# EAGLE board zx80 SD_12 (smd) build006.3 (STM32) (EAGLE 9.6.2), part 1 of 2
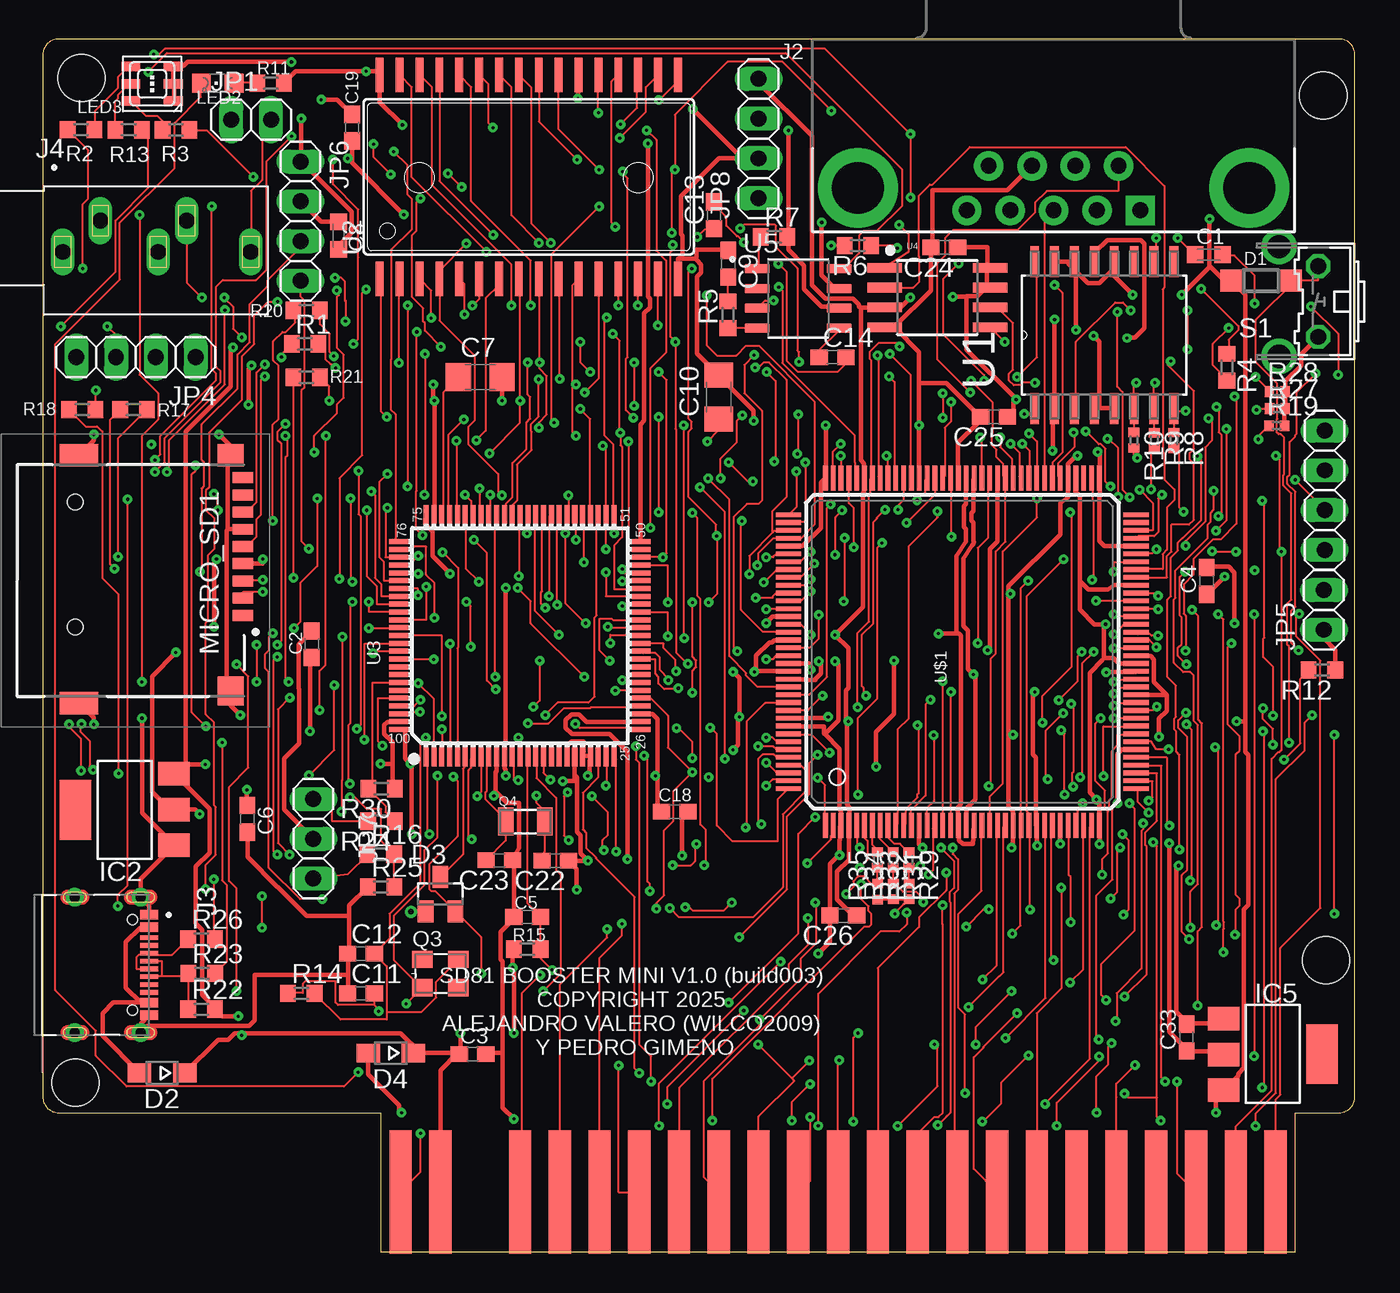
[diagram p3: board, top side]
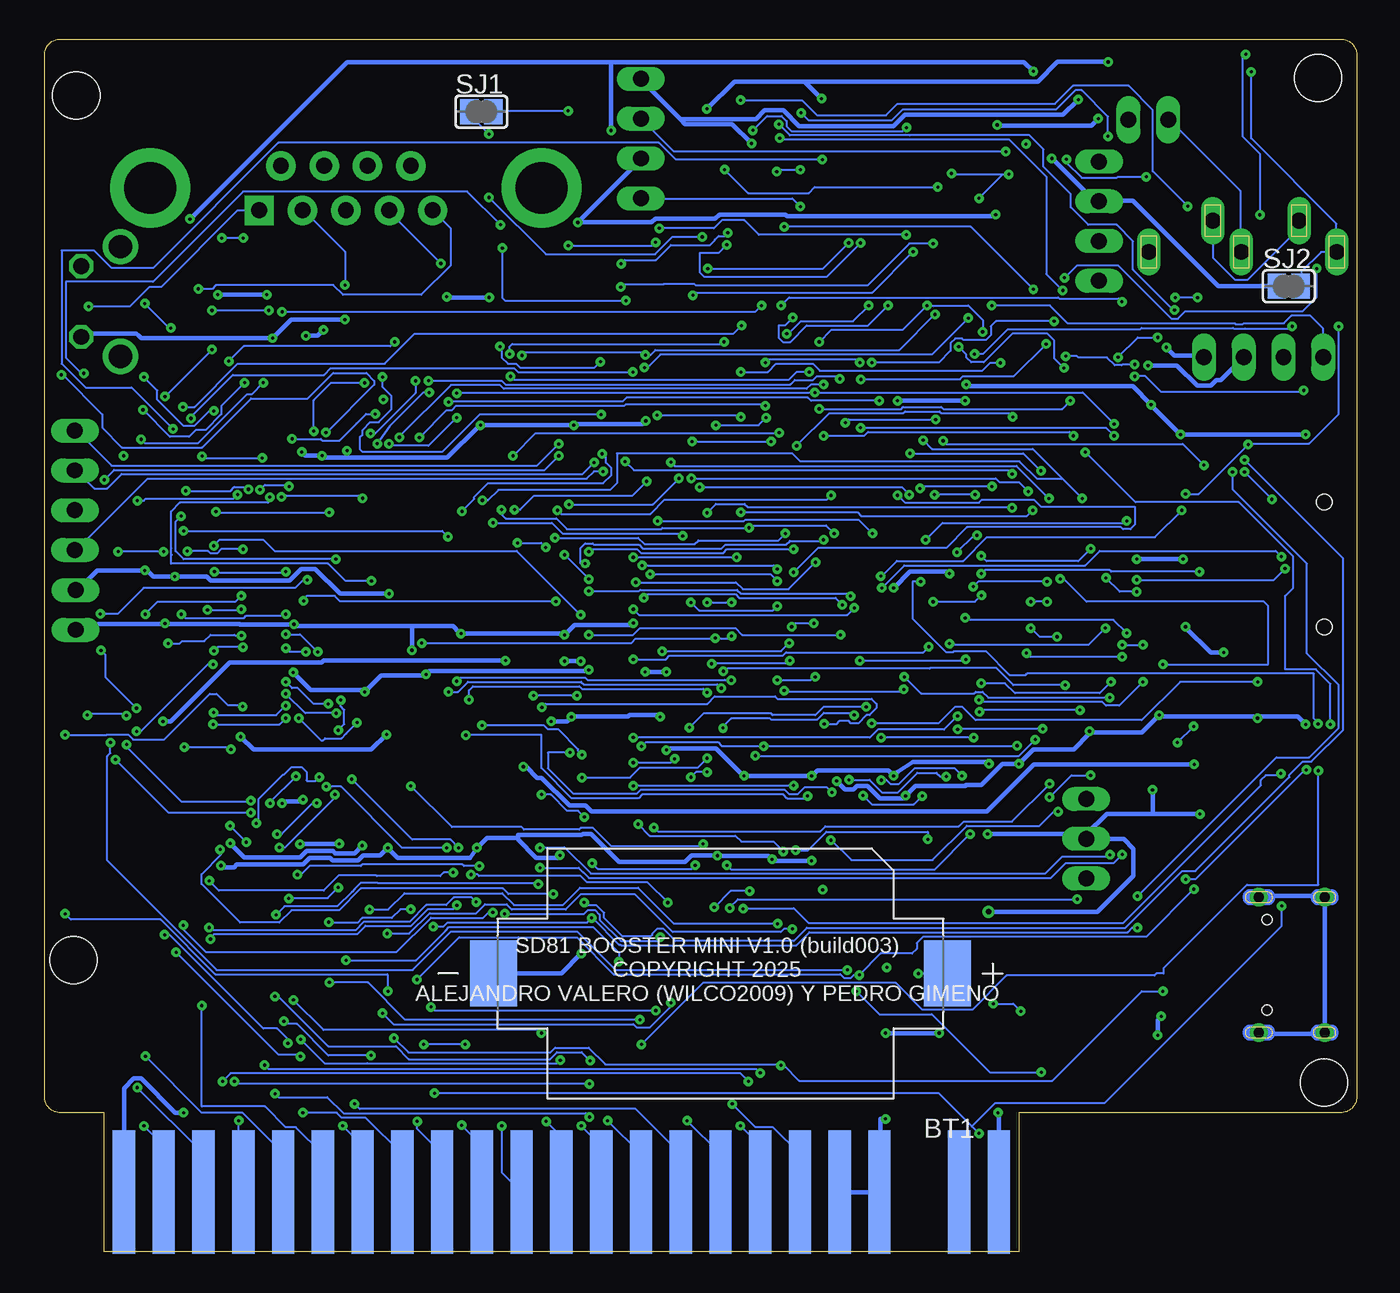
[diagram p4: board, bottom side, seen from below]

Size 83.82 x 77.47 mm. Coordinates in mm from the lower left corner, seen from the top.
Outline: 80.01,8.89 82.82,8.89 arc90 83.82,9.89 83.82,76.47 arc90 82.82,77.47 1,77.47 arc90 0,76.47 0,9.89 arc90 1,8.89 21.59,8.89 21.59,0 80.01,0 80.01,8.89
Copper layers (1*16): Top 0.035mm / dielectric 1.5mm / Bottom 0.035mm
Design rules "default *": minimum track width 5mil, minimum drill 0.2mm, track to track 5mil, track to pad 5mil, pad to pad 5mil, via to via 5mil, smd to smd 5mil, copper to edge 20mil, drill to drill 6mil, minimum pad ring 10mil, minimum via ring 8mil, stop-mask expansion 4mil, vias tented up to drill 999mil, thermal gap 10mil
Net classes: 1 VCC: width 0.3 mm; 2 3,3: width 0.3 mm
Holes 3 mm at 2.09,10.82 2.46,74.99 81.79,73.87 81.96,18.64

## Footprints (pad centres in the part's own frame; a part is rotated, then mirrored left to right if it is on the bottom)
EDGEPIN = smd 1.422 x 7.874: 1 0,0
BAT_CR2032-BS-6-1 = smd 3 x 4.2: N 14.5,0; P -14.5,0
C0603K = smd 1.05 x 1.08: 1 -0.875,0; 2 0.875,0
C0603 = smd 1.1 x 1: 1 -0.85,0; 2 0.85,0
C1206 = smd 1.6 x 1.8: 1 -1.4,0; 2 1.4,0
SOD123 = smd 1.4 x 1.4: A 1.9,0; C -1.9,0
SOD323-W = smd 1.5 x 1.2: A 1.45,0; C -1.45,0
SOT23 = smd 1 x 1.4: 1 -0.95,-1.1; 2 0.95,-1.1; 3 0,1.1
SOT223 = smd 1.499 x 2.007: 1 -2.261,-3.15; 2 0.025,-3.15; 3 2.311,-3.15 | smd 3.81 x 2.007: 4 0,3.15
DB9_MALE = drill 1.016 pad 1.88 square: 1 5.54,-1.42 | drill 1.016 pad 1.88: 2 2.77,-1.42; 3 0,-1.42; 4 -2.77,-1.42; 5 -5.54,-1.42; 6 4.15,1.42; 7 1.38,1.42; 8 -1.38,1.42; 9 -4.15,1.42 | drill 3.302 pad 5.08: G1 -12.5,0; G2 12.5,0
SHOUHAN_TYPE-C_16PIN_2MD__073_ = smd 0.6 x 1.14: A1_B12 -3.2,3.675; A4_B9 -2.4,3.675; B1_A12 3.2,3.675; B4_A9 2.4,3.675 | smd 0.3 x 1.14: A5 -1.25,3.675; A6 -0.25,3.675; A7 0.25,3.675; A8 1.25,3.675; B5 1.75,3.675; B6 0.75,3.675; B7 -0.75,3.675; B8 -1.75,3.675 | drill 0.65 pad 0.95: SH1 -4.325,3.125; SH2 4.325,3.125; SH3 -4.325,-1.075; SH4 4.325,-1.075 | hole 0.65: -2.89,2.605; 2.89,2.605
XKB_PJ-325C5-G = drill 1 long: 1 0,-0.9; 2 2.4,1.1; 3 7.92,1.1; 4 12,-0.9; 5 6.1,-0.9
1X02 = drill 1.016 long: 1 -1.27,0; 2 1.27,0
1X04 = drill 1.016 long: 1 -3.81,0; 2 -1.27,0; 3 1.27,0; 4 3.81,0
1X03 = drill 1.016 long: 1 -2.54,0; 2 0,0; 3 2.54,0
CHIPLED_0805 = smd 1.2 x 1.2: A 0,-1.05; C 0,1.05
3535-PLCC6 = smd 1.2 x 0.6: P1 1.35,-1.1; P2 1.35,0; P3 1.35,1.1; P4 -1.35,1.1; P5 -1.35,0; P6 -1.35,-1.1
TF-01A = smd 0.7 x 1.3: 1 2.23,7.174; 2 1.13,7.174; 3 0.03,7.174; 4 -1.07,7.174; 5 -2.17,7.174; 6 -3.27,7.174; 7 -4.37,7.174; 8 -5.47,7.174; CD1 -6.57,7.174 | smd 1.448 x 1.651: MP1 -7.989,6.4 | smd 1.448 x 2.438: MP2 -7.989,-3.3; MP3 7.836,-3.3 | smd 1.854 x 1.651: MP4 7.061,6.4 | hole 1: -5.004,-3.531; 2.972,-3.531
3.2X2.5_KX-7 = smd 1.3 x 1.1: 1 -1.15,-0.9; 2 1.15,-0.9; 3 1.15,0.9; 4 -1.15,0.9
3.2X1.5 = smd 1 x 1.8: 1 -1.25,0; 2 1.25,0
R0603 = smd 1 x 1.1: 1 -0.85,0; 2 0.85,0
R0402 = smd 0.6 x 0.7: 1 -0.5,0; 2 0.5,0
B3F-31XX = drill 1.016 octagon: 1 -2.261,-1.245; 2 2.261,-1.245 | drill 1.499 pad 2.159: 3 -3.505,1.245; 4 3.505,1.245
SJ = smd 1.168 x 1.6: 1 -0.762,0; 2 0.762,0
SOIC127P1032X265-16N = smd 1.981 x 0.559: 1 -4.699,4.445; 2 -4.699,3.175; 3 -4.699,1.905; 4 -4.699,0.635; 5 -4.699,-0.635; 6 -4.699,-1.905; 7 -4.699,-3.175; 8 -4.699,-4.445; 9 4.699,-4.445; 10 4.699,-3.175; 11 4.699,-1.905; 12 4.699,-0.635; 13 4.699,0.635; 14 4.699,1.905; 15 4.699,3.175; 16 4.699,4.445
SOP32-5 = smd 2.2 x 0.5: 1 -6.516,9.525; 2 -6.516,8.255; 3 -6.516,6.985; 4 -6.516,5.715; 5 -6.516,4.445; 6 -6.516,3.175; 7 -6.516,1.905; 8 -6.516,0.635; 9 -6.516,-0.635; 10 -6.516,-1.905; 11 -6.516,-3.175; 12 -6.516,-4.445; 13 -6.516,-5.715; 14 -6.516,-6.985; 15 -6.516,-8.255; 16 -6.516,-9.525; 17 6.516,-9.525; 18 6.516,-8.255; 19 6.516,-6.985; 20 6.516,-5.715; 21 6.516,-4.445; 22 6.516,-3.175; 23 6.516,-1.905; 24 6.516,-0.635; 25 6.516,0.635; 26 6.516,1.905; 27 6.516,3.175; 28 6.516,4.445; 29 6.516,5.715; 30 6.516,6.985; 31 6.516,8.255; 32 6.516,9.525
LQFP100-0.5-13.8X13.8MM = smd 1.2 x 0.32: 1 -7.75,6; 2 -7.75,5.5; 3 -7.75,5; 4 -7.75,4.5; 5 -7.75,4; 6 -7.75,3.5; 7 -7.75,3; 8 -7.75,2.5; 9 -7.75,2; 10 -7.75,1.5; 11 -7.75,1; 12 -7.75,0.5; 13 -7.75,0; 14 -7.75,-0.5; 15 -7.75,-1; 16 -7.75,-1.5; 17 -7.75,-2; 18 -7.75,-2.5; 19 -7.75,-3; 20 -7.75,-3.5; 21 -7.75,-4; 22 -7.75,-4.5; 23 -7.75,-5; 24 -7.75,-5.5; 25 -7.75,-6; 51 7.75,-6; 52 7.75,-5.5; 53 7.75,-5; 54 7.75,-4.5; 55 7.75,-4; 56 7.75,-3.5; 57 7.75,-3; 58 7.75,-2.5; 59 7.75,-2; 60 7.75,-1.5; 61 7.75,-1; 62 7.75,-0.5; 63 7.75,0; 64 7.75,0.5; 65 7.75,1; 66 7.75,1.5; 67 7.75,2; 68 7.75,2.5; 69 7.75,3; 70 7.75,3.5; 71 7.75,4; 72 7.75,4.5; 73 7.75,5; 74 7.75,5.5; 75 7.75,6 | smd 0.32 x 1.2: 26 -6,-7.75; 27 -5.5,-7.75; 28 -5,-7.75; 29 -4.5,-7.75; 30 -4,-7.75; 31 -3.5,-7.75; 32 -3,-7.75; 33 -2.5,-7.75; 34 -2,-7.75; 35 -1.5,-7.75; 36 -1,-7.75; 37 -0.5,-7.75; 38 0,-7.75; 39 0.5,-7.75; 40 1,-7.75; 41 1.5,-7.75; 42 2,-7.75; 43 2.5,-7.75; 44 3,-7.75; 45 3.5,-7.75; 46 4,-7.75; 47 4.5,-7.75; 48 5,-7.75; 49 5.5,-7.75; 50 6,-7.75; 76 6,7.75; 77 5.5,7.75; 78 5,7.75; 79 4.5,7.75; 80 4,7.75; 81 3.5,7.75; 82 3,7.75; 83 2.5,7.75; 84 2,7.75; 85 1.5,7.75; 86 1,7.75; 87 0.5,7.75; 88 0,7.75; 89 -0.5,7.75; 90 -1,7.75; 91 -1.5,7.75; 92 -2,7.75; 93 -2.5,7.75; 94 -3,7.75; 95 -3.5,7.75; 96 -4,7.75; 97 -4.5,7.75; 98 -5,7.75; 99 -5.5,7.75; 100 -6,7.75
SO08-EIAJ = smd 0.61 x 2.21: 1 -1.905,-3.378; 2 -0.635,-3.378; 3 0.635,-3.378; 4 1.905,-3.378; 5 1.905,3.353; 6 0.635,3.353; 7 -0.635,3.353; 8 -1.905,3.353
SOIC127P600X170-8N = smd 1.58 x 0.59: 1 -2.625,1.905; 2 -2.625,0.635; 3 -2.625,-0.635; 4 -2.625,-1.905; 5 2.625,-1.905; 6 2.625,-0.635; 7 2.625,0.635; 8 2.625,1.905
TQ144 = smd 1.6 x 0.3: P1 -11.1,8.75; P2 -11.1,8.25; P3 -11.1,7.75; P4 -11.1,7.25; P5 -11.1,6.75; P6 -11.1,6.25; P7 -11.1,5.75; P8 -11.1,5.25; P9 -11.1,4.75; P10 -11.1,4.25; P11 -11.1,3.75; P12 -11.1,3.25; P13 -11.1,2.75; P14 -11.1,2.25; P15 -11.1,1.75; P16 -11.1,1.25; P17 -11.1,0.75; P18 -11.1,0.25; P19 -11.1,-0.25; P20 -11.1,-0.75; P21 -11.1,-1.25; P22 -11.1,-1.75; P23 -11.1,-2.25; P24 -11.1,-2.75; P25 -11.1,-3.25; P26 -11.1,-3.75; P27 -11.1,-4.25; P28 -11.1,-4.75; P29 -11.1,-5.25; P30 -11.1,-5.75; P31 -11.1,-6.25; P32 -11.1,-6.75; P33 -11.1,-7.25; P34 -11.1,-7.75; P35 -11.1,-8.25; P36 -11.1,-8.75; P73 11.1,-8.75; P74 11.1,-8.25; P75 11.1,-7.75; P76 11.1,-7.25; P77 11.1,-6.75; P78 11.1,-6.25; P79 11.1,-5.75; P80 11.1,-5.25; P81 11.1,-4.75; P82 11.1,-4.25; P83 11.1,-3.75; P84 11.1,-3.25; P85 11.1,-2.75; P86 11.1,-2.25; P87 11.1,-1.75; P88 11.1,-1.25; P89 11.1,-0.75; P90 11.1,-0.25; P91 11.1,0.25; P92 11.1,0.75; P93 11.1,1.25; P94 11.1,1.75; P95 11.1,2.25; P96 11.1,2.75; P97 11.1,3.25; P98 11.1,3.75; P99 11.1,4.25; P100 11.1,4.75; P101 11.1,5.25; P102 11.1,5.75; P103 11.1,6.25; P104 11.1,6.75; P105 11.1,7.25; P106 11.1,7.75; P107 11.1,8.25; P108 11.1,8.75 | smd 0.3 x 1.6: P37 -8.75,-11.1; P38 -8.25,-11.1; P39 -7.75,-11.1; P40 -7.25,-11.1; P41 -6.75,-11.1; P42 -6.25,-11.1; P43 -5.75,-11.1; P44 -5.25,-11.1; P45 -4.75,-11.1; P46 -4.25,-11.1; P47 -3.75,-11.1; P48 -3.25,-11.1; P49 -2.75,-11.1; P50 -2.25,-11.1; P51 -1.75,-11.1; P52 -1.25,-11.1; P53 -0.75,-11.1; P54 -0.25,-11.1; P55 0.25,-11.1; P56 0.75,-11.1; P57 1.25,-11.1; P58 1.75,-11.1; P59 2.25,-11.1; P60 2.75,-11.1; P61 3.25,-11.1; P62 3.75,-11.1; P63 4.25,-11.1; P64 4.75,-11.1; P65 5.25,-11.1; P66 5.75,-11.1; P67 6.25,-11.1; P68 6.75,-11.1; P69 7.25,-11.1; P70 7.75,-11.1; P71 8.25,-11.1; P72 8.75,-11.1; P109 8.75,11.1; P110 8.25,11.1; P111 7.75,11.1; P112 7.25,11.1; P113 6.75,11.1; P114 6.25,11.1; P115 5.75,11.1; P116 5.25,11.1; P117 4.75,11.1; P118 4.25,11.1; P119 3.75,11.1; P120 3.25,11.1; P121 2.75,11.1; P122 2.25,11.1; P123 1.75,11.1; P124 1.25,11.1; P125 0.75,11.1; P126 0.25,11.1; P127 -0.25,11.1; P128 -0.75,11.1; P129 -1.25,11.1; P130 -1.75,11.1; P131 -2.25,11.1; P132 -2.75,11.1; P133 -3.25,11.1; P134 -3.75,11.1; P135 -4.25,11.1; P136 -4.75,11.1; P137 -5.25,11.1; P138 -5.75,11.1; P139 -6.25,11.1; P140 -6.75,11.1; P141 -7.25,11.1; P142 -7.75,11.1; P143 -8.25,11.1; P144 -8.75,11.1

## Placement (x,y rotation side)
1A  D7  [EDGEPIN]  22.86,3.81 0 top
1B  VCC  [EDGEPIN]  22.86,3.81 180 bottom
2A  /RAMCS  [EDGEPIN]  25.4,3.81 0 top
2B  9V  [EDGEPIN]  25.4,3.81 180 bottom
4A  D0  [EDGEPIN]  30.48,3.81 0 top
4B  GND  [EDGEPIN]  30.48,3.81 180 bottom
5A  D1  [EDGEPIN]  33.02,3.81 0 top
5B  GND  [EDGEPIN]  33.02,3.81 180 bottom
6A  D2  [EDGEPIN]  35.56,3.81 0 top
6B  /CLOCK  [EDGEPIN]  35.56,3.81 180 bottom
7A  D6  [EDGEPIN]  38.1,3.81 0 top
7B  A0  [EDGEPIN]  38.1,3.81 180 bottom
8A  D5  [EDGEPIN]  40.64,3.81 0 top
8B  A1  [EDGEPIN]  40.64,3.81 180 bottom
9A  D3  [EDGEPIN]  43.18,3.81 0 top
9B  A2  [EDGEPIN]  43.18,3.81 180 bottom
10A  D4  [EDGEPIN]  45.72,3.81 0 top
10B  A3  [EDGEPIN]  45.72,3.81 180 bottom
11A  A6  [EDGEPIN]  48.26,3.81 0 top
11B  A15  [EDGEPIN]  48.26,3.81 180 bottom
12A  /NMI  [EDGEPIN]  50.8,3.81 0 top
12B  A14  [EDGEPIN]  50.8,3.81 180 bottom
13A  /HALT  [EDGEPIN]  53.34,3.81 0 top
13B  A13  [EDGEPIN]  53.34,3.81 180 bottom
14A  /MREQ  [EDGEPIN]  55.88,3.81 0 top
14B  A12  [EDGEPIN]  55.88,3.81 180 bottom
15A  /IORQ  [EDGEPIN]  58.42,3.81 0 top
15B  A11  [EDGEPIN]  58.42,3.81 180 bottom
16A  /RD  [EDGEPIN]  60.96,3.81 0 top
16B  A10  [EDGEPIN]  60.96,3.81 180 bottom
17A  /WR  [EDGEPIN]  63.5,3.81 0 top
17B  A9  [EDGEPIN]  63.5,3.81 180 bottom
18A  /BUSAK  [EDGEPIN]  66.04,3.81 0 top
18B  A8  [EDGEPIN]  66.04,3.81 180 bottom
19A  /WAIT  [EDGEPIN]  68.58,3.81 0 top
19B  A7  [EDGEPIN]  68.58,3.81 180 bottom
20A  /BUSRQ  [EDGEPIN]  71.12,3.81 0 top
20B  A6  [EDGEPIN]  71.12,3.81 180 bottom
21A  /RESET  [EDGEPIN]  73.66,3.81 0 top
21B  A5  [EDGEPIN]  73.66,3.81 180 bottom
22A  /M1  [EDGEPIN]  76.2,3.81 0 top
22B  A4  [EDGEPIN]  76.2,3.81 180 bottom
23A  /RFSH  [EDGEPIN]  78.74,3.81 0 top
23B  /ROMCS  [EDGEPIN]  78.74,3.81 180 bottom
BT1  CR2032-BS-6-1  [BAT_CR2032-BS-6-1]  40.64,17.78 180 bottom
C1  220uF  [C0603K]  74.49,63.71 0 top
C2  100nF  [C0603]  17.17,38.81 270 top
C3  10uF  [C0603]  27.45,12.63 0 top
C4  100nF  [C0603]  74.34,42.86 90 top
C5  22pF  [C0603]  30.94,21.39 0 top
C6  10uF  [C0603]  13.07,27.66 270 top
C7  10uF  [C1206]  27.94,55.88 0 top
C8  100nF  [C0603K]  18.88,64.92 270 top
C9  1uF  [C0603]  43.78,63.12 270 top
C10  10uF  [C1206]  43.18,54.61 90 top
C11  22pF  [C0603]  20.32,16.51 0 top
C12  22pF  [C0603]  20.32,19.05 0 top
C13  1uF  [C0603]  42.87,66.22 90 top
C14  470uF  [C0603]  50.45,57.15 0 top
C18  100nF  [C0603]  40.37,28.11 0 top
C19  100nF  [C0603]  19.75,71.81 270 top
C22  22pF  [C0603]  32.73,25 180 top
C23  22pF  [C0603]  29.16,25.02 180 top
C24  0.1uF  [C0603]  57.58,64.17 180 top
C25  0.1uF  [C0603]  60.76,53.34 180 top
C26  100nF  [C0603]  51.13,21.49 180 top
C33  10uF  [C0603]  73.05,13.7 90 top
D1  1n4148  [SOD123]  77.81,62.03 0 top
D2  1n5819  [SOD323-W]  7.62,11.43 180 top
D3  BAT54C  [SOT23]  25.4,22.86 0 top
D4  1n5819  [SOD323-W]  22.23,12.7 180 top
IC2  REG1117  [SOT223]  5.23,28.23 90 top
IC5  1.2V  [SOT223]  78.57,12.64 270 top
J2  JOYSTICK  [DB9_MALE]  64.57,67.96 0 top
J3  TYPE-C_16PIN_2MD__073_  [SHOUHAN_TYPE-C_16PIN_2MD__073_]  3.12,18.33 270 top
J4  PJ-325C5-G  [XKB_PJ-325C5-G]  1.27,64.77 0 top
JP1  [1X02]  13.3,72.32 0 top
JP3  JTAG  [1X04]  81.88,48.65 90 top
JP4  SERIAL  [1X04]  5.94,57.16 180 top
JP5  [1X02]  81.83,41.01 90 top
JP6  PS2  [1X04]  16.46,65.84 270 top
JP7  BOOT  [1X03]  17.28,26.39 270 top
JP8  ST-LINK-V2  [1X04]  45.72,71.12 90 top
LED2  SD  [CHIPLED_0805]  11.18,74.66 90 top
LED3  STATUS  [3535-PLCC6]  6.98,74.62 0 top
MICRO_SD1  TF-01A  [TF-01A]  5.6,42.89 270 top
Q3  8MHz  [3.2X2.5_KX-7]  25.4,17.78 0 top
Q4  32767Hz  [3.2X1.5]  30.82,27.49 0 top
R1  300R  [R0603]  16.75,58 0 top
R2  150  [R0603]  2.44,71.69 0 top
R3  68  [R0603]  8.51,71.67 180 top
R4  75R  [R0603]  75.64,56.51 270 top
R5  100R  [R0603]  43.76,59.86 90 top
R6  100R  [R0603]  52.06,64.28 180 top
R7  10K  [R0603]  46.71,64.84 0 top
R8  270  [R0402]  72.25,51.84 270 top
R9  270  [R0402]  71,51.83 270 top
R10  270  [R0402]  69.69,51.85 270 top
R11  680  [R0603]  14.56,74.66 180 top
R12  2K  [R0603]  81.71,37.16 180 top
R13  150  [R0603]  5.48,71.67 180 top
R14  1M  [R0603]  16.51,16.51 0 top
R15  3K3  [R0603]  30.94,19.34 180 top
R16  510  [R0603]  21.59,25.4 0 top
R17  3k3  [R0603]  5.79,53.81 180 top
R18  3k3  [R0603]  2.52,53.8 0 top
R19  75R  [R0402]  78.82,52.77 0 top
R20  3k3  [R0603]  16.85,60.14 0 top
R21  3k3  [R0603]  16.85,55.86 180 top
R22  1K5  [R0603]  10.14,15.5 0 top
R23  22R  [R0603]  10.16,17.78 0 top
R24  510  [R0603]  21.63,27.51 180 top
R25  10K  [R0603]  21.6,23.3 0 top
R26  22R  [R0603]  10.13,19.98 0 top
R27  75R  [R0402]  78.87,53.87 0 top
R28  75R  [R0402]  78.85,54.94 0 top
R29  1K  [R0402]  55.32,25.04 270 top
R30  10K  [R0603]  21.63,29.59 180 top
R31  1K  [R0402]  54.32,25.04 270 top
R32  1K  [R0402]  53.32,25.04 270 top
R33  2K  [R0402]  55.34,23.03 90 top
R34  2K  [R0402]  54.34,23.03 90 top
R35  2K  [R0402]  53.33,23.01 90 top
S1  RESET  [B3F-31XX]  80.22,60.71 90 top
SJ1  [SJ]  55.92,72.83 0 bottom
SJ2  [SJ]  4.34,61.69 0 bottom
U1  AD724JRZ  [SOIC127P1032X265-16N]  67.8,58.56 90 top
U2  AS6C4008  [SOP32-5]  31.04,68.68 90 top
U3  MCU-STM32F407VET6(LQFP100)  [LQFP100-0.5-13.8X13.8MM]  30.48,39.37 90 top
U4  25F32006WSOI  [SO08-EIAJ]  57.15,60.96 270 top
U5  PAM8302AADCR  [SOIC127P600X170-8N]  48.25,60.91 0 top
U$1  XC6SLX9-2TQG144C  [TQ144]  58.74,38.34 90 top

## Tracks (layer width: path | path; a pad name or v marks a point on that pad's centre or on a via)
1V2  (via drill 0.2)
  Top 0.3: IC5.2 75.41,12.65 75.41,12.81 73.09,12.81 C33.1 73.05,12.97 71.96,14.06 v71.96,26.09 | U$1.P19 59.01,27.25 59.01,28.33 59.57,28.89 59.57,36.89 v59.45,36.89 59.1,37.24 59.1,39.68 58.81,39.98 58.81,44.3 59.34,45.13 59.44,45.23 59.44,45.28 59.47,45.32 59.44,45.46 59.44,46.59 59.33,46.7 59.33,47.2 59.44,47.32 59.44,49.36 59.49,49.41 U$1.P89 | v49.05,37.17 48.93,37.29 48.93,37.57 47.65,37.57 U$1.P128 | v63.37,35.77 63.25,35.65 63.25,31.77 63.45,31.57 63.45,27.25 U$1.P28 63.49,27.09 63.49,25.95 v63.52,25.95 | v67.93,37.01 67.93,37.05 69.81,37.05 U$1.P52
  Bottom 0.3: v49.05,37.17 49.13,37.09 59.25,37.09 v59.45,36.89 59.57,36.81 62.33,36.81 v63.37,35.77 63.45,35.89 66.81,35.89 v67.93,37.01 | v63.52,25.95 64.01,25.46 65.24,25.46 65.39,25.62 67.07,25.62 67.49,25.2 71.07,25.2 v71.96,26.09
3V3  (via drill 0.2, 0.35)
  Top 0.3: v14.05,44.25 14.05,43.97 12.81,43.97 MICRO_SD1.4 | v11.09,44.25 10.93,44.09 v10.93,39.94 | v8.49,38.29 6.97,36.77 6.97,29.37 8.09,28.25 IC2.2 8.49,28.25 9.73,28.25 v10.01,27.97 | 39.25,30.41 39.25,34.05 38.93,34.37 U3.28 | 39.25,30.41 39.25,28.13 39.49,28.13 C18.1 | U3.19 33.49,31.65 33.49,32.33 33.77,32.61 34.53,32.61 34.53,31.89 34.49,31.85 34.49,31.65 U3.21 34.61,31.69 34.85,31.69 U3.22 34.97,31.41 34.93,31.37 34.93,30.53 v34.81,30.41 | v29.57,30.41 29.57,30.81 29.49,30.89 U3.11 29.49,31.73 29.49,32.33 29.57,32.41 v29.57,42.41 | U3.100 23.13,33.37 23.13,31.53 v23.49,31.17 23.57,31.05 v23.57,26.69 | v26.01,43.33 24.89,44.45 24.89,46.01 24.41,46.49 24.41,46.81 24.49,46.89 24.49,47.09 U3.75 | v39.13,30.41 39.25,30.41 | v64.99,26.07 64.97,26.09 64.97,27.21 U$1.P31 | v67.49,26.06 67.53,26.1 67.53,26.97 67.49,27.01 67.49,27.21 U$1.P36 67.47,27.25 67.47,28.89 v67.3,28.89 67.28,28.94 66.87,29.35 66.87,36.99 67.69,37.81 67.77,37.93 | v68.65,28.65 68.65,31.81 68.89,32.05 68.89,32.09 69.81,32.09 U$1.P42 | R12.1 82.57,38.45 81.81,39.21 81.81,39.72 JP5.1 | 67.77,37.93 68.37,37.93 68.73,37.57 69.81,37.57 U$1.P53 | 67.77,37.93 67.77,40.09 v67.89,40.09 67.18,40.09 66.25,41.02 66.25,42.86 | U$1.P63 68.46,42.59 68.05,42.32 66.79,42.32 66.25,42.86 | U$1.P76 65.97,49.41 65.97,48.57 66.25,48.29 66.25,42.86 | U3.50 38.17,45.37 38.17,52.85 38.41,53.09 38.41,59.97 38.77,60.33 38.77,60.89 38.65,61.01 v38.65,70.81 | U$1.P20 59.49,27.21 59.49,27.05 59.45,27.01 59.45,26.29 59.41,26.25 59.41,26.05 58.77,26.05 58.53,26.29 58.53,26.85 58.49,26.89 58.49,27.21 U$1.P18 58.45,27.37 58.45,28.17 58.41,28.21 58.41,28.37 58.65,28.61 58.65,39.37 58.53,39.49
  Top 0.3: C24.1 58.45,64.17 60.33,64.17 60.33,62.89 60.37,62.85 60.49,62.85 U4.8 60.29,62.73 60.29,61.61 60.49,61.61 U4.7 60.17,61.53 59.69,61.05 59.01,61.05 | C25.1 61.97,53.33 62.01,53.37 62.01,54.29 v62.17,54.45 62.09,54.57 59.01,57.65 59.01,61.05 | 45.57,37.09 47.61,37.09 U$1.P129 | 45.57,37.09 45.57,38.09 46.41,38.93 46.57,38.93 46.69,39.05 47.61,39.05 U$1.P125 | v50.17,34.17 50.17,34.09 U$1.P135 | v46.21,40.17 46.61,40.57 47.61,40.57 U$1.P122 | 52.25,60.33 U4.3 53.89,60.33 54.77,60.33 v55.41,60.97 | 52.25,60.33 52.25,50.57 52.45,50.37 52.45,49.57 | 52.45,49.57 U$1.P103 | v44.09,37.05 44.49,36.65 v44.49,34.17 44.41,34.05 44.41,32.37 v44.09,32.05 | v45.45,37.05 45.57,37.09 | v58.13,61.01 58.89,61.01 59.01,61.05 | JP8.4 45.73,74.69 49.13,71.29 49.13,63.49 49.12,63.39 49.12,61.77 50,60.89 51.75,60.89 52.12,60.52 52.12,60.39 52.25,60.33 | C2.1 16.33,38.81 16.33,35.99 16.38,35.94 16.38,32.47 15.42,31.52 15.42,28.25 JP7.2 | v17.78,73.61 18.8,73.61 C19.1 | C6.1 13.03,28.57 v13.03,29.52 | 52.45,49.57 52.44,49.56 52.44,48.51 52.39,48.46 52.39,41.19 v50.61,39.41 51.45,38.57 51.45,36.01 51.29,35.85 51.29,33.93 v51.45,33.89 51.37,33.81 51.37,28.57 51.57,28.37 51.57,28.21 51.53,28.17 51.53,27.37 U$1.P4 51.49,25.04 50.73,24.29 50.73,22.51 51.75,21.49 C26.1 | D3.1 23.56,21.76 v23.52,21.72 | U$1.P90 58.96,49.41 58.97,49.4 58.97,47.78 58.83,47.63 58.83,46.31 58.96,46.18 58.96,45.37 58.36,44.44 58.36,39.49 58.53,39.49 | 58.53,39.49 v57.21,39.49 | v76.12,40.14 76.12,43.39 75.75,43.77 74.38,43.77 C4.2 | U$1.P86 60.99,45.37 60.51,44.89 60.51,38.58 v60.36,38.43
  Bottom 0.3: v11.09,44.25 v14.05,44.25 | v10.93,39.94 10.93,39.9 9.32,38.29 v8.49,38.29 | v10.01,27.97 13.03,27.97 | 13.03,27.97 15.97,27.97 17.28,26.65 17.28,26.37 | v23.49,31.17 23.62,31.3 28.36,31.3 29.33,30.65 v29.57,30.41 29.92,30.76 34.46,30.76 v34.81,30.41 v39.13,30.41 39.25,30.49 40.93,32.17 43.97,32.17 v44.09,32.05 | v26.01,43.33 26.13,43.45 28.53,43.45 v29.57,42.41 | v23.57,26.69 17.93,26.69 JP7.2 17.48,26.37 17.28,26.37 | v67.49,26.06 67.48,26.07 v64.99,26.07 | v67.3,28.89 67.43,28.76 68.54,28.76 v68.65,28.65 | 76.12,40.11 71.34,40.11 71.36,40.09 v67.89,40.09 67.77,40.01 67.73,39.97 60.33,39.97 | 76.12,40.11 80.38,40.11 80.76,39.74 JP5.1 | v38.65,70.81 39.89,72.05 42.89,72.05 43.2,72.37 | 43.2,72.37 45.29,74.45 45.29,74.93 JP8.4 | v51.45,33.89 50.45,33.89 v50.17,34.17 50.05,34.21 46.53,34.21 46.45,34.29 44.61,34.29 v44.49,34.17 | v46.21,40.17 46.33,40.05 49.97,40.05 v50.61,39.41 50.73,39.49 v57.21,39.49 57.33,39.57 57.73,39.97 60.33,39.97 | v44.09,37.05 v45.45,37.05 | v58.13,61.01 58.09,60.97 v55.41,60.97 | v13.03,29.52 13.03,27.97 | 43.2,72.37 38.37,72.37 37.81,72.92 36.61,72.92 35.61,71.92 29.58,71.92 28.86,72.63 18.76,72.63 v17.78,73.61 | 60.33,39.97 60.33,38.45 v60.36,38.43 | 17.28,26.37 14.89,26.37 14.27,25.75 14.27,24.02 16.56,21.72 v23.52,21.72 | v76.12,40.14 76.12,40.11
/CLOCK  (via drill 0.2)
  Top 0.127: v59.13,15.65 61.09,17.61 61.11,17.61 61.37,17.87 61.37,27.13 61.45,27.21 U$1.P24 | v44.77,15.41 39.89,10.53 v39.89,9.45
  Bottom 0.127: v44.77,15.41 58.89,15.41 v59.13,15.65 | v39.89,9.45 38.41,7.97 37.29,7.97 35.57,6.25 6B.1
/HALT  (via drill 0.2)
  Top 0.127: v68.41,34.09 69.81,34.09 U$1.P46 | v73.05,33.69 73.36,33.38 73.36,23.77 v73.3,23.7 | v57.72,24.23 57.72,23.1 55.97,21.35 55.97,20.75 53.34,18.12 13A.1
  Bottom 0.127: v68.41,34.09 68.81,33.69 v73.05,33.69 | v57.72,24.23 58.32,24.23 58.54,24.01 62.6,24.01 62.64,24.05 65.02,24.05 65.98,23.09 72.68,23.09 v73.3,23.7
/IORQ  (via drill 0.2)
  Top 0.127: v68.41,36.41 68.41,36.57 69.81,36.57 U$1.P51 | v65.7,35 65.85,34.85 65.85,30.7 65.75,30.59 65.75,29.81 v65.82,29.73 | 15A.1 58.2,4.02 58.22,4.04 58.22,22.89 58.46,23.13 58.46,25.07 58.13,25.41 v58.13,25.81
  Bottom 0.127: v68.41,36.41 68.01,36.01 67.64,36.01 66.63,35 v65.7,35 | v58.13,25.81 60.97,25.81 64.89,29.73 65.48,29.73 v65.82,29.73
/M1  (via drill 0.2)
  Top 0.127: v78.77,50.85 78.97,50.65 78.97,44.87 v79.12,44.73 79.12,32.05 79.09,32.03 78.99,31.93 78.92,31.93 78.49,31.5 78.49,10.31 76.21,8.03 22A.1 | U$1.P67 69.85,44.61 70.87,44.61 v71.14,44.88 | v74.7,44.77 74.74,44.73 v76.21,44.73
  Bottom 0.127: v71.14,44.88 72.54,44.88 72.81,44.61 73.22,44.61 73.37,44.77 v74.7,44.77 | v76.21,44.73 v79.12,44.73
/MEM_OE  (via drill 0.2)
  Top 0.127: v58.05,45.69 58.05,49.37 58.01,49.41 U$1.P92 | v74.93,46.05 75.61,46.73 v75.61,52.57 | v34.13,69.77 31.69,72.21 31.69,75.17 U2.24
  Bottom 0.127: v58.05,45.69 58.41,46.05 v74.93,46.05 | v75.61,52.57 78.25,55.21 81.2,55.21 82.73,56.74 82.73,63.97 80.65,63.97 79.53,62.85 76.89,62.85 68.89,70.85 44.57,70.85 43.49,69.77 v34.13,69.77
/MREQ  (via drill 0.2)
  Top 0.127: v68.41,34.89 68.41,35.05 69.81,35.05 U$1.P48 | v57.48,22.13 57.48,20.93 57.49,20.91 57.49,8.88 57.22,8.61 56.95,8.61 55.88,7.53 14A.1 | v73.02,34.45 72.53,33.96 72.53,33.48 73.1,32.9 73.1,24.41 72.77,24.08 72.77,20.43 v73.22,19.98
  Bottom 0.127: v68.41,34.89 69.01,34.29 72.86,34.29 v73.02,34.45 | v57.48,22.13 57.72,21.9 59.32,21.9 60.39,20.82 63.31,20.82 63.85,20.29 73.01,20.29 73.32,19.98 v73.22,19.98
/NMI  (via drill 0.2)
  Top 0.127: v67.45,13.57 67.29,13.57 67.29,22.75 68.32,23.78 68.32,28.25 68.13,28.44 68.13,28.87 68.28,29.02 68.28,31.96 68.32,32 68.32,32.04 68.65,32.37 68.65,33.05 69.81,33.05 U$1.P44 | 12A.1 50.8,11.93 51.03,12.17 50.96,12.24 v50.87,12.24
  Bottom 0.127: v67.45,13.57 65.93,12.05 63.19,12.05 63.17,12.03 51.08,12.03 v50.87,12.24
/OE_OL  (via drill 0.2)
  Top 0.127: v39.93,41.49 39.93,43.85 38.25,43.85 U3.47 | v56.7,35.27 56.39,34.96 56.39,29.15 55.45,28.21 55.45,27.25 U$1.P12 | v41.49,35.73 41.49,37.12 41.73,37.36 41.73,37.78 41.49,38.02 v41.49,41.49
  Bottom 0.127: v41.49,41.49 v39.93,41.49 | v41.49,35.73 41.73,35.97 49.49,35.97 49.65,36.13 56.44,36.13 56.7,35.87 v56.7,35.27
/RD  (via drill 0.2)
  Top 0.127: 16A.1 59.47,5.3 59.47,12.43 60.09,13.05 60.09,13.1 v62.23,15.24 | v43.81,15.91 48.26,20.36 48.26,26.7 v49.33,27.78 | v52.07,29.21 52.07,34.11 53.3,35.34 53.3,44.59 53.3,44.98 v53.61,45.29 | v51.81,45 51.81,47.5 51.49,47.82 U$1.P105
  Bottom 0.127: v62.23,15.24 61.53,14.54 46.19,14.54 45.99,14.33 45.15,14.33 43.81,15.67 v43.81,15.91 | v49.33,27.78 49.73,28.18 50.43,28.18 51.47,29.21 v52.07,29.21 | v53.61,45.29 52.1,45.29 v51.81,45
/RESET  (via drill 0.2)
  Top 0.127: U3.96 21.41,35.37 21.41,32.61 v21.69,32.33 | v45.69,32.29 46.65,32.29 46.85,32.09 47.61,32.09 U$1.P139 | v72.45,10.89 72.45,5.01 21A.1 | v38.85,10.89 38.85,12.5 38.09,13.26 38.09,31.25 37.89,31.45 v37.89,32.29
  Bottom 0.127: 37.89,32.33 40.57,32.33 40.81,32.57 45.41,32.57 v45.69,32.29 | 37.89,32.33 v21.69,32.33 | v72.45,10.89 71.93,11.41 39.37,11.41 v38.85,10.89 | v37.89,32.29 37.89,32.33
/RFSH  (via drill 0.2)
  Top 0.127: v67.04,42.92 67.1,42.92 67.13,42.95 67.13,47.93 67.09,47.97 67.09,49.33 67.01,49.41 U$1.P74 | v80.25,40.76 80.06,40.57 80.06,39.31 81.61,37.77 81.61,21.97 79.05,19.41 79.05,10.03 78.74,9.72 23A.1
  Bottom 0.127: v67.04,42.92 67.29,42.92 67.81,42.41 71.12,42.41 71.19,42.41 77.49,42.41 79.14,40.76 v80.25,40.76
/WAIT  (via drill 0.2)
  Top 0.127: 19A.1 68.58,9.88 68.57,9.89 68.57,10.74 v69.76,11.93 | v38.1,11.43 37.81,11.72 37.81,22.66 35.34,25.14 35.34,25.19 34.71,25.81 34.71,26.75 34.5,26.97 34.5,29.33 35.48,30.31 U3.23
  Bottom 0.127: v69.76,11.93 69.52,11.69 38.36,11.69 v38.1,11.43
/WR  (via drill 0.2)
  Top 0.127: v64.9,35.25 66.09,36.44 66.09,38.05 v66.37,38.33 | v68.41,39.45 69.01,40.05 69.81,40.05 U$1.P58 | v65.06,23.27 | v65.06,23.27 65.06,16.82 63.49,15.25 17A.1 | v68.82,25.83 68.61,25.62 68.61,22.97 v68.22,22.57 | v65.27,29.21 65.27,33.11 v65.06,33.32
  Bottom 0.127: v66.37,38.33 67.49,39.45 v68.41,39.45 | v68.22,22.57 68.19,22.6 65.73,22.6 v65.06,23.27 | v68.82,25.83 68.46,25.83 65.27,29.02 v65.27,29.21 | v64.9,35.25 64.9,34.86 64.67,34.62 64.67,33.71 v65.06,33.32
/WR'  (via drill 0.2)
  Top 0.127: 52.95,49.47 52.89,49.53 52.89,56.97 52.8,57.06 52.8,57.49 53.36,58.05 54.51,58.05 v54.73,57.83 | 52.95,49.47 52.97,49.45 U$1.P102 | v48.31,56.86 48.31,57.48 48.2,57.59 48.2,62.83 46.84,64.2 46.84,65.55 46.76,65.63 44.79,65.63 v44.55,65.39 | v28.77,64.97 25.33,68.41 25.33,75.17 U2.29 | v52.05,34.78 52.05,39.55 52.77,40.27 52.77,48.33 52.88,48.44 52.88,49.41 52.95,49.47 | U3.26 38.15,33.45 34.29,33.45 v34.01,33.73
  Bottom 0.127: v52.05,34.78 51.82,35.01 41.47,35.01 41.01,35.48 37.16,35.48 37.01,35.33 30.99,35.33 30.66,35.01 30.66,34.74 31.11,34.29 31.3,34.29 31.82,33.77 32.31,33.77 32.44,33.9 33.04,33.9 33.21,33.73 v34.01,33.73 | v44.55,65.39 41.06,65.39 40.56,65.89 39.11,65.89 38.19,64.97 v28.77,64.97 | v54.73,57.83 54.62,57.73 54.62,57.14 54.21,56.73 53.69,56.73 53.45,56.49 48.68,56.49 v48.31,56.86
A0  (via drill 0.2)
  Top 0.127: v64.56,18.62 64.41,18.62 64.41,27.17 64.45,27.21 U$1.P30 | v47.13,18.53 39.37,10.77 v39.37,8.05
  Bottom 0.127: v39.37,8.05 38.13,6.81 38.13,3.81 7B.1 | v64.56,18.62 60.08,18.62 58.21,20.5 58.21,20.51 57.97,20.75 48.78,20.75 47.13,19.11 v47.13,18.53
A0'  (via drill 0.2)
  Top 0.127: v13.65,38.77 v13.65,36.41 | v14.97,38.77 15.21,39.01 15.21,51.65 14.97,51.89 14.97,52.37 v15.49,52.89 | v34.61,54.89 35.49,55.77 35.49,62.13 U2.12 | v61.81,51.62 62.37,51.06 62.37,49.53 62.45,49.45 U$1.P83 | v57.49,54.85 v57.49,53.29 | v24.12,35.26 23.73,34.87 U3.97
  Bottom 0.127: v24.12,35.26 23.99,35.13 16.25,35.13 16.01,34.89 15.17,34.89 v13.65,36.41 | v14.97,38.77 v13.65,38.77 | v15.49,52.89 17.49,54.89 v34.61,54.89 34.65,54.85 v57.49,54.85 | v61.81,51.62 61.69,51.5 59.28,51.5 v57.49,53.29
A1  (via drill 0.2)
  Top 0.127: v66.43,28.67 66.09,28.32 66.09,27.33 66.01,27.25 U$1.P33 | v68.96,26.68 69.33,26.32 69.33,21.84 v69.02,21.54 | v42.77,8.37 42.77,11.07 52.48,20.78 52.8,20.78 52.92,20.9 52.92,21.59 52.75,21.77 52.75,22.08 52.27,22.56 v52.27,23.47
  Bottom 0.127: v68.96,26.68 68.67,26.68 66.75,28.6 66.5,28.6 v66.43,28.67 | v42.77,8.37 40.65,6.25 8B.1 | v52.27,23.47 52.35,23.55 62.23,23.55 62.54,23.55 63.63,23.55 64.01,23.18 64.18,23 65.11,22.07 68.49,22.07 v69.02,21.54
A1'  (via drill 0.2)
  Top 0.127: U3.98 22.82,34.46 24.08,34.46 24.1,34.48 v24.1,34.49 | v34.05,52.13 33.81,52.37 33.81,55.41 | 33.81,55.41 33.81,61.73 34.21,62.13 U2.11 | v61.16,52.03 61.16,51.4 61.89,50.66 61.89,49.53 61.97,49.45 U$1.P84 | 33.81,55.41 v34.05,55.41 | v17.67,34.61 17.67,37.11 18.05,37.48 18.05,52.09 v18.09,52.13
  Bottom 0.127: v24.1,34.49 23.98,34.61 v17.67,34.61 | v18.09,52.13 18.33,52.37 31.21,52.37 31.45,52.13 v34.05,52.13 | v61.16,52.03 61.16,52.08 57.86,55.37 54.73,55.37 54.49,55.13 35.13,55.13 34.85,55.41 v34.05,55.41
A2  (via drill 0.2)
  Top 0.127: v64.01,9.45 66.89,12.33 66.89,27.13 66.97,27.21 U$1.P35
  Bottom 0.127: v64.01,9.45 63.69,9.13 46.05,9.13 43.21,6.29 43.21,3.81 9B.1
A2'  (via drill 0.2)
  Top 0.127: U3.1 24.57,31.53 24.57,26.81 v24.69,26.69 | v41.75,26.05 41.65,25.96 41.65,24.95 41.4,24.7 v40.23,24.7 | v33.01,55.77 33.01,62.09 32.97,62.13 U2.10 | v59.29,55.65 60.64,54.3 60.67,54.27 60.67,52.29 60.64,52.25 60.64,51.52 60.92,51.24 60.92,50.76 61.35,50.33 61.35,49.57 U$1.P85 61.5,49.43 61.5,45.37 60.88,44.74 60.88,38.21 60.56,37.9 60.56,29.75 v60.42,29.75
  Bottom 0.127: v60.42,29.75 57.8,27.13 53.34,27.13 53.19,26.98 49.66,26.98 49.58,27.07 48.77,27.07 47.63,25.93 41.87,25.93 v41.75,26.05 | v33.01,55.77 33.17,55.93 34.49,55.93 34.73,55.69 35.89,55.69 36.17,55.41 54.37,55.41 54.61,55.65 v59.29,55.65 | v40.23,24.7 39.97,24.44 26.94,24.44 v24.69,26.69
A3  (via drill 0.2)
  Top 0.127: v71.69,10.89 71.45,11.13 71.45,31.05 69.85,31.05 U$1.P40 | v49.01,10.73 47.85,9.57 v47.85,8.37
  Bottom 0.127: v71.69,10.89 71.53,10.73 v49.01,10.73 | v47.85,8.37 45.73,6.25 10B.1
A3'  (via drill 0.2)
  Top 0.127: v23.98,36.32 24.97,35.33 24.97,31.65 U3.2 | v15.69,36.41 15.49,36.61 15.49,50.73 15.61,50.85 15.61,52.01 v15.49,52.13 | U2.9 31.69,62.13 31.69,56.81 v31.73,56.81 31.73,56.41 32.19,55.95 32.19,53.48 31.69,52.99 v31.69,52.65 | v59.87,52.02 59.94,51.96 59.94,49.48 59.97,49.45 U$1.P88 | v37.77,56.81 v37.77,54.05
  Bottom 0.127: v23.98,36.32 22.46,36.32 21.82,35.69 16.41,35.69 v15.69,36.41 | v15.49,52.13 16.01,52.65 v31.69,52.65 | v37.77,54.05 37.85,54.13 46.69,54.13 46.77,54.05 57.52,54.05 57.8,53.77 58.13,53.77 v59.87,52.02 | v37.77,56.81 37.57,57.01 31.93,57.01 v31.73,56.81
A4  (via drill 0.2)
  Top 0.127: v77.47,8.04 77.47,8.85 78.77,10.15 78.77,30.2 80.61,32.03 80.61,33.81 v81.09,34.29 | v78.59,34.26 78.59,37.37 77.96,38 77.96,39.17 78.03,39.24 78.03,47.86 v77.9,47.99 | v71.49,48.37 71.25,48.13 71.25,45.97 71,45.72 69.97,45.72 U$1.P69
  Bottom 0.127: 22B.1 76.2,6.77 v77.47,8.04 | v81.09,34.29 80.99,34.39 78.59,34.39 v78.59,34.26 | v77.9,47.99 77.47,47.99 77.35,48.12 71.74,48.12 v71.49,48.37
A4'  (via drill 0.2)
  Top 0.127: v25.49,33.37 25.49,31.65 U3.3 | v20.05,33.41 20.29,33.65 20.29,47.01 20.17,47.13 v20.17,49.89 | v28.53,51.01 30.45,52.93 30.45,54.37 | 30.45,54.37 30.45,62.09 30.41,62.13 U2.8 | v58.01,54.29 58.01,53.05 57.61,52.65 57.61,49.57 U$1.P93 | v30.49,54.37 30.45,54.37
  Bottom 0.127: v25.49,33.37 25.45,33.41 v20.05,33.41 | v20.17,49.89 21.29,51.01 v28.53,51.01 | v58.01,54.29 57.97,54.33 46.89,54.33 46.65,54.57 35.05,54.57 34.85,54.37 v30.49,54.37
A5  (via drill 0.2)
  Top 0.127: v68.41,43.45 68.41,44.05 69.81,44.05 U$1.P66 | v77.94,33.24 77.99,33.2 77.99,10.59 v77.89,10.49 | v73.05,37.53 72.51,38.07 72.51,38.59 72.75,38.83 72.75,40.53 72.62,40.66 72.62,43.11 v72.96,43.45
  Bottom 0.127: v68.41,43.45 68.46,43.4 72.96,43.4 v72.96,43.45 | v77.94,33.24 77.81,33.12 73.4,37.53 v73.05,37.53 | v77.89,10.49 73.69,6.29 73.69,3.81 21B.1
A5'  (via drill 0.2)
  Top 0.127: v26.01,38.85 26.01,31.65 U3.4 | v16.05,39.85 16.45,40.25 16.45,42.73 17.53,43.81 v17.53,48.13 | v27.69,51.85 28.29,52.45 28.29,60.93 29.13,61.77 29.13,62.13 U2.7 | v55.85,48.01 56.37,48.53 56.37,49.33 56.45,49.41 U$1.P95
  Bottom 0.127: v26.01,38.85 25.93,38.77 17.13,38.77 v16.05,39.85 | 18.81,49.41 20.69,51.29 27.13,51.29 v27.69,51.85 | 18.81,49.41 v17.53,48.13 | v55.85,48.01 55.49,48.01 54.82,48.68 47.68,48.68 47.25,49.11 47.25,51.01 36.05,51.01 35.53,50.49 21.53,50.49 20.41,49.37 18.85,49.37 18.81,49.41
A6  (via drill 0.2)
  Top 0.127: v71.97,27.21 71.79,27.39 71.79,31.57 69.85,31.57 U$1.P41 | v70.93,26.17 71.17,25.93 71.17,9.85 | 71.17,9.85 71.17,8.61 v71.41,8.37 | v49.01,8.61 49.01,4.53 48.29,3.81 11A.1 | 71.17,9.85 69.34,9.85 v69.09,10.1
  Bottom 0.127: v70.93,26.17 v71.97,27.21 | v71.41,8.37 71.41,3.81 20B.1 | v49.01,8.61 49.25,8.85 64.72,8.85 65.75,9.88 68.87,9.88 v69.09,10.1
A6'  (via drill 0.2)
  Top 0.127: v25.53,44.69 26.53,43.69 26.53,38.61 26.49,38.57 26.49,31.65 U3.5 | v27.45,60.45 27.85,60.85 27.85,62.13 U2.6 | v54.05,55.93 54.41,55.57 54.41,49.49 54.45,49.45 U$1.P99 | v34.97,56.21 34.33,56.85 v34.33,58.13 | v23.89,58.77 23.89,48.62 23.85,48.59 23.85,46.17 v24.25,45.77
  Bottom 0.127: v25.53,44.69 24.45,45.77 v24.25,45.77 | v23.89,58.77 23.89,59.53 24.81,60.45 v27.45,60.45 29.01,58.89 33.57,58.89 v34.33,58.13 | v54.05,55.93 53.81,55.69 36.29,55.69 35.77,56.21 v34.97,56.21
A7  (via drill 0.2)
  Top 0.127: U$1.P62 69.86,42.07 71.08,42.07 v71.25,41.9 | v77.37,12.49 77.38,12.5 v77.38,40.73
  Bottom 0.127: v71.25,41.9 71.62,41.53 76.58,41.53 v77.38,40.73 | v77.37,12.49 73.77,8.89 71.17,8.89 68.61,6.33 68.61,3.81 19B.1
A7'  (via drill 0.2)
  Top 0.127: U3.38 37.29,39.37 37.25,39.41 36.25,39.41 v36.25,38.89 | v44.37,38.37 44.13,38.61 44.13,46.93 44.97,47.77 45.72,47.77 45.93,47.98 45.93,53.73 44.8,54.85 44.8,56.66 v45.43,57.29 | v53.32,57.27 53.37,57.23 53.37,49.55 53.47,49.44 U$1.P101 | v26.93,59.89 26.93,61.81 26.61,62.13 U2.5
  Bottom 0.127: v36.25,38.89 36.77,38.37 v44.37,38.37 | v53.32,57.27 53.35,57.3 53.35,57.46 45.61,57.46 v45.43,57.29 45.12,57.29 44.8,57.61 29.21,57.61 v26.93,59.89
A8  (via drill 0.2)
  Top 0.127: v71.25,41.05 69.85,41.05 U$1.P60 | v73.77,15.73 73.77,20.48 74.04,20.75 74.04,33.75 73.8,34 73.8,40.62 v73.41,41.01
  Bottom 0.127: v71.25,41.05 71.29,41.01 v73.41,41.01 | v73.77,15.73 73.77,9.29 69.73,9.29 68.41,7.97 67.77,7.97 66.05,6.25 18B.1
A8'  (via drill 0.2)
  Top 0.127: v36.09,39.93 36.09,39.89 38.21,39.89 U3.39 | v34.67,40.15 33.37,41.45 v33.37,45.89 | v54.63,47.41 54.63,47.68 54.97,48.02 54.97,49.41 U$1.P98 | v28.76,71.82 28.45,72.12 28.45,74.61 27.89,75.17 U2.27 | v38.57,71.65 39.19,71.03 39.19,63.94 39.81,63.32 39.81,57.45 38.81,56.45 v38.81,46.25
  Bottom 0.127: v36.09,39.93 35.87,40.15 v34.67,40.15 | v33.37,45.89 33.89,46.41 38.81,46.41 v38.81,46.25 44.36,46.25 44.44,46.17 50.44,46.17 51.12,46.85 54.36,46.85 54.59,47.08 54.59,47.38 v54.63,47.41 | v28.76,71.82 v28.77,71.82 29.01,71.58 36.1,71.58 36.42,71.9 36.42,72.24 36.74,72.56 37.66,72.56 v38.57,71.65
A9  (via drill 0.2)
  Top 0.127: v68.41,40.73 68.41,40.61 69.81,40.61 U$1.P59 | v67.48,12.48 67.48,12.23 64.77,9.52 v64.77,8.05 | v75.08,40.73 75.41,40.4 75.41,21.11 75.45,21.07 75.45,20.66 75.41,20.62 v75.41,19.13
  Bottom 0.127: v68.41,40.73 | v75.41,19.13 68.88,12.6 67.6,12.6 v67.48,12.48 | v64.77,8.05 63.53,6.81 63.53,3.81 17B.1 | v75.08,40.73 74.84,40.49 71.08,40.49 70.93,40.64 68.5,40.64 v68.41,40.73
A9'  (via drill 0.2)
  Top 0.127: U3.40 36.41,40.37 36.33,40.45 35.57,40.45 35.57,38.41 v36.21,37.77 | v41.21,37.57 41.15,37.57 40.45,38.27 40.45,52.53 40.41,52.57 v40.41,58.13 40.09,58.45 40.09,63.85 40.24,64 v40.24,64.34 | v54.1,57.36 55.45,56.01 55.45,49.45 U$1.P97 | v31.69,64.45 29.93,66.21 29.93,74.41 29.17,75.17 U2.26
  Bottom 0.127: v36.21,37.77 36.37,37.61 41.17,37.61 v41.21,37.57 | v40.41,58.13 40.54,58 53.94,58 54.1,57.83 v54.1,57.36 | v31.69,64.45 33.85,62.29 41.69,62.29 41.97,62.57 41.97,63.81 40.77,63.81 v40.24,64.34
A10  (via drill 0.2)
  Top 0.127: v67.31,8.89 67.31,11.22 68.04,11.95 68.04,13.09 v68.27,13.32 | v76.15,20.25 76.2,20.31 76.2,21.87 76.45,22.12 76.45,22.55 76.21,22.79 76.21,31.8 76.45,32.03 76.45,32.94 75.69,33.7 75.69,38.62 v75.93,38.86 | v71.24,39.37 70.81,39.37 70.73,39.45 69.97,39.45 U$1.P57
  Bottom 0.127: 16B.1 60.96,6.22 63.31,8.57 64.84,8.57 65.16,8.89 v67.31,8.89 | v68.27,13.32 68.27,13.57 68.97,14.27 69.85,14.27 75.81,20.23 76.12,20.23 v76.15,20.25 | v75.93,38.86 75.17,38.86 75.03,39.01 73.61,39.01 73.21,39.41 71.67,39.41 71.64,39.37 v71.24,39.37
A10'  (via drill 0.2)
  Top 0.127: v39.93,39.33 39.93,40.85 38.25,40.85 U3.41 | v35.53,69.13 32.96,71.7 U2.23 | v37.05,69.01 37.05,68.89 37.36,68.58 37.36,57.16 37.25,57.05 37.25,53.77 v37.73,53.29 | v40.93,52.81 40.97,52.77 v40.97,39.21 | U$1.P87 60.37,49.32 60.37,45.61 59.73,44.97 v59.73,38.89
  Bottom 0.127: v39.93,39.33 40.09,39.17 40.97,39.17 | 40.97,39.17 46.05,39.17 46.33,38.89 v59.73,38.89 | v37.05,69.01 37.05,69.13 v35.53,69.13 | v37.73,53.29 38.21,52.81 v40.93,52.81 | v40.97,39.21 40.97,39.17
A11  (via drill 0.2)
  Top 0.127: v68.41,38.57 69.81,38.57 U$1.P55 | v67.13,38.33 66.38,37.58 66.38,30.44 v66.27,30.33 | v62.96,12.55 61.21,10.8 61.21,9.46 60.08,8.33 v60.01,8.33 | v70.29,27.37 70.29,27.01 70.18,26.9 70.18,18.09 68.61,16.52 68.61,14.81 v68.53,14.73
  Bottom 0.127: v68.41,38.57 68.17,38.33 v67.13,38.33 | v70.29,27.37 70.13,27.37 70.13,28.93 68.58,30.48 68.52,30.48 68.04,30.96 67.39,30.96 67.09,30.66 67.09,30.12 67.06,30.09 66.5,30.09 v66.27,30.33 | v60.01,8.33 60.01,7.85 58.45,6.29 58.45,3.81 15B.1 | v62.96,12.55 65.69,12.55 67.69,14.55 68.53,14.55 v68.53,14.73
A11'  (via drill 0.2)
  Top 0.127: U3.42 37.01,41.37 v37.01,41.25 | v42.53,41.49 43.05,42.01 v43.05,45.73 43.01,45.77 43.01,46.45 41.25,48.21 41.25,52.4 41.45,52.59 41.45,53.02 41.25,53.23 41.25,62.57 41.23,62.59 v41.45,62.81 | v55.17,46.57 56.97,48.37 56.97,49.41 U$1.P94 | v32.45,64.45 31.21,65.69 31.21,74.37 30.41,75.17 U2.25
  Bottom 0.127: v37.01,41.25 37.29,40.97 42.01,40.97 v42.53,41.49 | v43.05,45.73 43.21,45.89 50.73,45.89 51.41,46.57 v55.17,46.57 | v32.45,64.45 34.09,62.81 v41.45,62.81
A12  (via drill 0.2)
  Top 0.127: v68.41,35.65 68.81,36.05 69.81,36.05 U$1.P50 | v65.19,34.41 64.05,33.27 64.05,30.33 v64.19,30.19 | v57.17,8.09 57.71,8.63 57.77,8.69 57.97,8.89 57.97,22.34 57.92,22.38 57.92,22.95 58.21,23.23 58.21,24.97 v57.37,25.81
  Bottom 0.127: v68.41,35.65 67.17,34.41 v65.19,34.41 | v64.19,30.19 60.33,26.33 57.89,26.33 v57.37,25.81 | v57.17,8.09 55.89,6.81 14B.1
A12'  (via drill 0.2)
  Top 0.127: v35.97,43.41 35.97,41.89 38.21,41.89 U3.43 | v29.33,48.33 29.09,48.57 29.09,49.69 27.17,51.61 27.17,52.69 27.57,53.09 27.57,57.25 25.33,59.49 25.33,62.13 U2.4 25.33,62.21 25.33,62.69 v27.05,64.41 | U$1.P104 51.97,49.45 51.89,49.53 51.89,50.41 51.87,50.43 51.87,52.15 47.24,56.78 47.24,61.41 v47.01,61.64
  Bottom 0.127: v35.97,43.41 34.41,44.97 26.21,44.97 24.89,46.29 15.05,46.29 14.93,46.17 14.45,46.17 14.17,46.45 14.17,47.61 20.17,47.61 20.61,48.05 23.93,48.05 24.13,47.85 28.85,47.85 v29.33,48.33 | v47.01,61.64 47.01,61.81 44.27,61.81 42.29,61.81 42.21,61.73 31.25,61.73 28.57,64.41 v27.05,64.41
A13  (via drill 0.2)
  Top 0.127: v54.61,8.04 57.16,10.59 57.16,13.04 v56.94,13.25 | v82.5,21.59 82.5,32.97 82.55,33.02 v82.5,33.02 | v71.16,34.83 71.1,34.83 70.86,34.59 U$1.P47 | v59.59,13.25 59.59,14.36 v61.88,16.64
  Bottom 0.127: v82.5,21.59 82.13,21.22 76.4,21.22 72.91,17.73 61.93,17.73 61.88,17.68 v61.88,16.64 | v82.5,33.02 79.85,33.02 79.83,33.05 78.48,33.05 78.16,32.72 76.19,32.72 73.27,35.65 72.83,35.65 72.11,34.93 71.26,34.93 v71.16,34.83 | v54.61,8.04 54.61,5.08 13B.1 | v56.94,13.25 v59.59,13.25
A13'  (via drill 0.2)
  Top 0.127: U3.44 37.29,42.37 37.25,42.33 36.49,42.33 36.49,45.13 37.01,45.65 37.01,51.41 36.89,51.53 v36.89,52.33 36.85,52.37 36.85,58.21 v36.41,58.65 | v53.89,50.85 53.97,50.77 53.97,49.45 U$1.P100 | v31.17,60.45 31.17,63.33 27.37,67.13 27.37,74.41 26.61,75.17 U2.28
  Bottom 0.127: v36.89,52.33 36.93,52.29 52.45,52.29 v53.89,50.85 | v31.17,60.45 32.17,59.45 35.49,59.45 36.29,58.65 v36.41,58.65
A14  (via drill 0.2)
  Top 0.127: v67.76,30.38 67.76,33.57 69.81,33.57 U$1.P45 | v69.41,28.65 69.72,28.34 69.72,20.5 67.61,18.39 67.61,16.4 v67.92,16.09 | v51.78,8.33 51.78,13.68 v52.07,13.97
  Bottom 0.127: v69.41,28.65 69.41,28.72 v67.76,30.38 | v67.76,30.38 | v67.92,16.09 66,14.17 52.27,14.17 v52.07,13.97 | 12B.1 50.8,7.35 v51.78,8.33
A14'  (via drill 0.2)
  Top 0.127: v37.01,42.85 38.21,42.85 U3.45 | v45.13,43.29 45.13,44.45 46.65,45.97 | 46.65,45.97 46.73,46.05 47.61,46.05 U$1.P111 | v24.81,59.65 24.81,61.41 24.09,62.13 U2.3 | 46.65,45.97 46.61,46.01 46.61,47.33 47.49,48.21 47.49,55.72 46.39,56.82 46.05,56.82 45.72,56.49 v45.5,56.49
  Bottom 0.127: v37.01,42.85 37.45,43.29 v45.13,43.29 | v24.81,59.65 27.13,57.33 44.48,57.33 45.22,56.6 45.6,56.6 v45.5,56.49
A15  (via drill 0.2)
  Top 0.127: v74.89,32.25 75.05,32.09 75.05,21.05 74.96,20.96 v74.96,20.86 | v49.53,8.05 49.53,16.5 53.49,20.46 54.72,20.46 55.18,20.93 v55.18,21.68 | v71.91,32.1 71.14,32.1 70.82,32.59 U$1.P43
  Bottom 0.127: v71.91,32.1 72.06,32.25 v74.89,32.25 | v74.96,20.86 74.96,20.59 73.5,19.13 61.35,19.13 59.13,21.34 55.8,21.34 55.46,21.68 v55.18,21.68 | v49.53,8.05 48.29,6.81 48.29,3.81 11B.1
A15'  (via drill 0.2)
  Top 0.127: U3.46 37.01,43.37 v37.01,43.61 | v45.65,43.85 45.69,43.89 45.69,44.61 46.65,45.57 47.61,45.57 U$1.P112 47.69,45.61 48.45,45.61 49.29,46.45 49.29,54.33 45.74,57.88 44.92,57.88 44.3,57.26 43.05,57.26 42.39,57.92 v42.39,61.11 | v28.33,63.89 23.57,68.65 23.57,74.41 22.81,75.17 U2.31
  Bottom 0.127: v37.01,43.61 37.25,43.85 v45.65,43.85 | v28.33,63.89 30.94,61.29 42.22,61.29 v42.39,61.11
A16'  (via drill 0.2)
  Top 0.127: U3.48 v39.61,44.37 39.85,44.61 39.85,55.69 v39.33,56.21 | v46.21,44.37 46.65,44.37 46.85,44.57 47.61,44.57 U$1.P114 | v22.75,56.79 22.75,62.08 U2.2
  Bottom 0.127: v46.21,44.37 v39.61,44.37 | v22.75,56.79 23.41,56.79 23.91,56.29 34.29,56.29 34.73,56.73 37.09,56.73 37.61,56.21 v39.33,56.21
A17'  (via drill 0.2)
  Top 0.127: v36.49,45.89 36.49,47.09 U3.51 36.45,47.17 36.45,51.57 35.89,52.13 35.89,59.57 v36.01,59.69 | v29.93,60.45 29.93,63.05 24.85,68.13 24.85,74.41 24.09,75.17 U2.30 | v51.21,45.61 51.21,41.6 v51.16,41.55 | v67.27,41.58 67.29,41.59 U$1.P61
  Bottom 0.127: v36.49,45.89 36.93,45.45 42.05,45.45 42.29,45.21 45.49,45.21 45.89,45.61 v51.21,45.61 | v29.93,60.45 31.21,59.17 35.13,59.17 36.17,58.13 36.65,58.13 36.93,58.41 36.93,59.17 36.53,59.17 v36.01,59.69 | v51.16,41.55 64.93,41.55 65.28,41.9 67.06,41.9 67.27,41.69 v67.27,41.58
A18'  (via drill 0.2)
  Top 0.127: v35.97,44.89 35.97,47.09 U3.52 35.97,47.17 35.97,51.29 v35.77,51.49 | v49.05,44.73 48.41,44.09 U$1.P115 | v21.97,53.33 21.58,53.72 21.58,62.08 21.53,62.13 U2.1
  Bottom 0.127: v35.97,44.89 40.21,44.89 40.45,44.65 45.73,44.65 45.97,44.89 48.89,44.89 v49.05,44.73 | v21.97,53.33 22.21,53.57 26.53,53.57 26.65,53.69 28.85,53.69 28.97,53.57 33.69,53.57 v35.77,51.49
AMPLI_OUT  (via drill 0.2)
  Top 0.127: v22.22,68.84 21.12,69.93 v21.12,70.77 | v26.75,68.02 v25.88,68.89 | v50.38,72.89 47.25,76.02 43.75,76.02 40.38,72.64 v40.38,69.14 40.17,68.94 v40.17,65.1 | v46.99,63.12 47.53,62.58 47.53,61.42 47.52,61.41 47.52,56.91 48.19,56.24 50.8,56.24 51.3,56.73 C14.2 | R1.2 18.04,57.56 18.04,57.03 18.37,56.7 18.46,56.7 v18.7,56.46 | v25.42,57.82 24.41,58.84 24.41,59.32 24.29,59.44 24.29,60.27 23.59,60.97 23.59,64.95 23.86,65.22 23.86,67.04 v24.13,67.31
  Bottom 0.127: v25.88,68.89 25.82,68.84 v22.22,68.84 22.6,68.84 v24.13,67.31 | v26.75,68.02 34.62,68.02 35,67.64 38.88,67.64 v40.38,69.14 | v50.38,72.89 55.12,72.89 SJ1.2 | v46.99,63.12 46.75,63.36 44.76,63.36 43.81,64.31 41.3,64.31 41,64.62 41,64.66 40.77,64.9 40.38,64.9 v40.17,65.1 | v18.7,56.46 19.31,57.07 19.31,58.21 19.75,58.65 22,58.65 23.82,56.83 24.62,56.83 24.93,57.13 24.93,57.33 v25.42,57.82
AMPLI_OUT'  (via drill 0.2)
  Top 0.127: J4.3 9.19,61.93 v10.16,60.96 | v11.59,60.96 11.59,60.93 12.15,60.38 12.15,58.97 v12.7,58.42 | v15.24,57.15 15.24,57.34 R1.1
  Bottom 0.127: J4.2 3.73,65.82 3.73,65.33 6.95,62.12 7.78,62.12 9.18,63.51 9.18,65.82 J4.3 | v10.16,60.96 v11.59,60.96 | v12.7,58.42 12.86,58.42 12.86,58.41 13.98,58.41 v15.24,57.15
B0  (via drill 0.2)
  Top 0.127: v34.57,44.05 34.57,47.01 34.49,47.09 U3.55 | v46.05,42.77 46.85,43.57 47.61,43.57 U$1.P116
  Bottom 0.127: v34.57,44.05 36.29,42.33 39.21,42.33 39.65,42.77 v46.05,42.77
B1  (via drill 0.2)
  Top 0.127: U3.56 34.05,47.05 v34.05,45.49 | v49.29,43.97 48.41,43.09 U$1.P117
  Bottom 0.127: v34.05,45.49 34.13,45.41 36.21,45.41 36.45,45.17 40.33,45.17 40.57,44.93 45.61,44.93 45.85,45.17 48.73,45.17 48.81,45.25 49.29,45.25 49.57,44.97 49.57,43.97 v49.29,43.97
B2  (via drill 0.2)
  Top 0.127: U3.57 33.57,47.21 v33.57,48.33 | v51.05,47.37 51.05,47.35 50.64,46.93 50.64,44.56 v50.61,44.53 | v49.05,42.97 48.69,42.61 47.65,42.61 U$1.P118
  Bottom 0.127: v33.57,48.33 33.85,48.05 44.21,48.05 45.12,47.14 50.82,47.14 v51.05,47.37 | v49.05,42.97 v50.61,44.53
B3  (via drill 0.2)
  Top 0.127: v32.85,41.33 32.85,46.13 32.89,46.17 32.89,47.01 32.97,47.09 U3.58 | v45.53,41.77 46.61,41.77 46.61,41.85 46.81,42.05 47.61,42.05 U$1.P119
  Bottom 0.127: v32.85,41.33 33.29,41.77 39.45,41.77 39.69,42.01 45.29,42.01 v45.53,41.77
B4  (via drill 0.2)
  Top 0.127: U3.59 32.37,47.01 32.37,41.93 v32.33,41.89 | v49.05,42.21 48.45,41.61 47.65,41.61 U$1.P120
  Bottom 0.127: v32.33,41.89 32.49,42.05 39.33,42.05 39.57,42.29 45.77,42.29 45.85,42.21 v49.05,42.21
B5  (via drill 0.2)
  Top 0.127: v32.09,41.13 31.81,41.41 31.81,42.13 31.89,42.21 31.89,47.01 31.97,47.09 U3.60 | v46.21,41.05 47.61,41.05 U$1.P121
  Bottom 0.127: v32.09,41.13 32.53,40.69 45.85,40.69 v46.21,41.05
B6  (via drill 0.2)
  Top 0.127: v32.97,39.41 31.45,40.93 31.45,47.09 U3.61 | v49.05,39.41 48.69,39.77 48.69,39.81 48.45,40.05 47.65,40.05 U$1.P123
  Bottom 0.127: v32.97,39.41 39.25,39.41 39.69,39.85 45.77,39.85 46.21,39.41 v49.05,39.41
B7  (via drill 0.2)
  Top 0.127: v30.93,45.89 30.93,47.05 30.97,47.09 U3.62 | v44.65,46.69 44.61,46.65 44.61,41.01 46.01,39.61 47.61,39.61 U$1.P124
  Bottom 0.127: v30.93,45.89 31.81,46.77 39.05,46.77 39.13,46.69 v44.65,46.69
BAT  (via drill 0.2)
  Top 0.127: v28,17.77 v27.99,17.78 27.99,20.12 D3.2 25.07,23.04 24.81,23.04 24.68,23.17 24.68,24.75 26.48,26.55 26.48,30.09 v26.21,30.37 | U3.16 31.98,30.59 v32.42,30.15
  Bottom 0.127: v28,17.77 BT1.P | v32.42,30.15 31.12,30.15 30.3,29.33 29.34,29.33 28.07,30.61 26.83,30.61 26.58,30.36 26.21,30.36 v26.21,30.37
BOOT0
  Top 0.127: R24.1 22.45,27.53 21.89,28.09 21.89,28.49 20.81,29.57 R30.2 21.05,29.41 21.05,36.37 U3.94
BRIGHT  (via drill 0.2)
  Top 0.127: U$1.P11 55.12,27.37 55.12,28.28 55.88,29.04 55.88,29.24 55.95,29.31 55.95,33.45 55.95,33.55 v55.87,33.63 | R35.1 53.35,22.53 R34.1 R33.1 55.01,22.2 54.97,22.2 54.42,21.66 v54.42,21.59 | v44.49,20.1 v44.49,20.11 47.55,23.16 47.55,27.83 48.97,29.25 48.97,31.23 v49.49,31.75
  Bottom 0.127: v54.42,21.59 49.34,21.59 49.09,21.84 48.66,21.84 48.35,21.54 48.35,21.21 47,19.86 44.49,19.86 v44.49,20.1 | v49.49,31.75 49.73,31.99 49.73,32.11 51,33.37 51.67,33.37 51.92,33.63 v55.87,33.63
CFG_CLK  (via drill 0.2)
  Top 0.127: v58.01,35.77 58.01,27.25 U$1.P17 | U3.35 38.25,37.85 39.13,37.85 39.13,36.93 39.33,36.73 39.33,36.3 39.68,35.94 40.53,35.94 v40.58,36
  Bottom 0.127: v40.58,36 40.83,36.25 49.37,36.25 49.53,36.41 56.77,36.41 57.41,35.77 v58.01,35.77
CFG_DATA  (via drill 0.2)
  Top 0.127: v20.53,32.73 20.57,32.77 20.57,38.85 22.73,38.85 U3.89 | v38.41,31.69 38.61,31.49 38.61,23.65 38.77,23.49 v38.77,23.05 | v56.57,24.1 56.85,24.37 56.85,27.02 U$1.P15 | v41.04,22.01 41.32,22.01 41.55,21.79 43.48,21.79 v44,22.31
  Bottom 0.127: v20.53,32.73 21.57,31.69 v38.41,31.69 | v38.77,23.05 39.99,23.05 v41.04,22.01 | v44,22.31 45.3,23.6 49.17,23.6 49.57,24.01 56.07,24.01 56.16,24.1 v56.57,24.1
CFG_RESET  (via drill 0.2)
  Top 0.127: v39.95,36.52 39.95,36.63 39.41,37.17 39.41,37.97 39.13,38.25 38.35,38.25 U3.36 | v57.49,36.45 U$1.P16
  Bottom 0.127: v57.49,36.45 57.25,36.69 49.3,36.69 49.14,36.53 40.38,36.53 40.37,36.52 v39.95,36.52
COMPOSITE  (via drill 0.2)
  Top 0.127: v74,61.52 76.38,59.14 76.38,58.89 75.75,58.27 75.75,57.39 R4.1
  Bottom 0.127: v74,61.52 73.12,61.52 72.88,61.77 65.38,61.77 64.75,61.14 59.75,61.14 57.88,63.02 57.88,65.39 59,66.52 J2.5
CS_LLS  (via drill 0.2)
  Top 0.127: v16.01,43.05 R21.2 | v14.05,42.17 12.81,42.17 12.81,41.77 MICRO_SD1.2
  Bottom 0.127: v16.01,43.05 15.13,42.17 v14.05,42.17
CSYNC  (via drill 0.2)
  Top 0.127: U$1.P10 54.62,27.37 54.62,33.39 55.31,34.08 55.31,45.07 57.15,46.91 v57.15,47.31 | v48.2,50.98 48.26,51.04 v48.26,53.5 | v62.23,55.88 63.5,57.15 63.5,63.12 U1.16
  Bottom 0.127: v57.15,47.31 56.37,48.09 56.37,48.23 55.49,49.11 48.14,49.11 47.61,49.63 47.61,50.06 47.96,50.41 47.96,50.91 48.03,50.98 v48.2,50.98 | v48.26,53.5 56.02,53.5 58.42,51.1 63.5,51.1 63.65,51.24 63.65,52.07 63.51,52.2 63.51,52.49 63,53 62.48,53 61.65,53.82 61.65,54.66 62.23,55.24 v62.23,55.88
CTRL_CLK  (via drill 0.2)
  Top 0.127: U3.90 21.09,38.37 v21.09,38.25 | v52.17,24.53 52.69,25.05 52.69,26.25 52.49,26.45 52.49,27.21 U$1.P6 | v14.97,38.01 14.73,37.77 14.73,25.63 v14.97,25.38
  Bottom 0.127: v21.09,38.25 20.85,38.01 v14.97,38.01 | v52.17,24.53 49.7,24.53 49.41,24.25 49.4,24.25 49.04,23.88 19.54,23.88 | 19.54,23.88 18.58,24.84 15.52,24.84 14.98,25.38 v14.97,25.38 | 19.54,23.88
D0  (via drill 0.2)
  Top 0.127: v60.03,17.39 60.93,18.29 60.93,27.17 60.97,27.21 U$1.P23 | v31.77,17.69 30.61,16.53 30.61,3.93 4A.1 | v36.77,60.45 36.77,62.13 U2.13 | v10.4,23.17 10.4,24.72 11.05,25.37 11.05,28.41 10.93,28.53 10.93,33.81 10.41,34.33 10.41,40.18 10.56,40.34 10.56,44.52 10.97,44.92 10.97,46.84 10.41,47.4 10.41,48.62 10.61,48.82 10.61,52.33 12.72,54.44 12.72,57.21 13.5,57.99 13.5,59.81 14.38,60.7 v14.99,60.7
  Bottom 0.127: v10.4,23.17 13.43,20.13 27.69,20.13 28.09,19.73 28.09,19.36 28.4,19.05 30.41,19.05 v31.77,17.69 32.12,17.69 32.31,17.49 32.75,17.49 32.99,17.73 47.46,17.73 49.8,20.07 53.53,20.07 53.55,20.1 57.32,20.1 v60.03,17.39 | v36.77,60.45 36.25,60.97 19.06,60.97 18.99,60.9 15.2,60.9 v14.99,60.7
D1  (via drill 0.2)
  Top 0.127: v61.93,20.33 62.45,20.85 62.45,27.21 U$1.P26 62.49,27.29 62.49,42.41 v62.94,42.86 | v36.04,20.63 36.04,20.08 33.05,17.09 33.05,3.81 5A.1 | v38.01,60.45 38.01,62.13 U2.14 | v68.65,60.05 v68.65,60.06 68.62,60.04 68.62,55.27 68.96,54.93 68.96,48.68 v69.43,48.21
  Bottom 0.127: v38.01,60.45 38.41,60.05 v68.65,60.05 | v62.94,42.86 64.59,42.86 65.7,43.97 75.73,43.97 75.73,44.48 75.69,44.52 75.72,44.55 75.72,44.93 75.73,44.94 75.73,47.3 75.18,47.85 69.54,47.85 69.43,47.95 v69.43,48.21 | v61.93,20.33 60.51,20.33 59.22,21.63 56.25,21.63 55.68,22.2 54.3,22.2 53.97,21.87 50.53,21.87 49.56,22.84 46.1,22.84 43.7,20.44 36.78,20.44 36.59,20.63 v36.04,20.63
D2  (via drill 0.2)
  Top 0.127: v63.06,21.87 63.02,21.92 63.02,27.21 U$1.P27 62.97,27.29 62.97,28.05 62.85,28.17 62.85,41.89 v65.21,44.25 | v37,20.95 37,20.21 35.57,18.79 6A.1 | v39.29,59.17 39.29,62.13 U2.15 | v75.09,47 75.29,47.2 75.29,52.19 75.12,52.37 75.12,53.83 v74.98,53.97 | v74.98,53.97
  Bottom 0.127: v39.29,59.17 39.81,58.65 60.17,58.65 62.09,56.73 71.48,56.73 74.24,53.97 v74.98,53.97 | v75.09,47 75.44,46.65 75.44,44.76 74.93,44.25 v65.21,44.25 | v37,20.95 43.6,20.95 45.89,23.25 49.61,23.25 50.7,22.16 53.84,22.16 54.59,22.91 60.82,22.91 61.86,21.87 v63.06,21.87
D3  (via drill 0.2)
  Top 0.127: v65.62,17.2 66.46,18.04 66.46,27.19 U$1.P34 | 9A.1 42.22,4.77 42.22,10.92 45.78,14.48 v45.78,14.83 48.44,17.48 48.44,18.76 49.39,19.72 49.39,22.27 v49.35,22.32 | v39.36,73.57 40.55,74.76 40.55,75.18 U2.17 | v10.79,66.8 10.79,56.39 11.07,56.11 11.07,55.69 7.51,52.13 7.51,50.94 v7.16,50.59